# EAGLE design PANELMETRE_arduino_v4 (EAGLE 7.7.0)
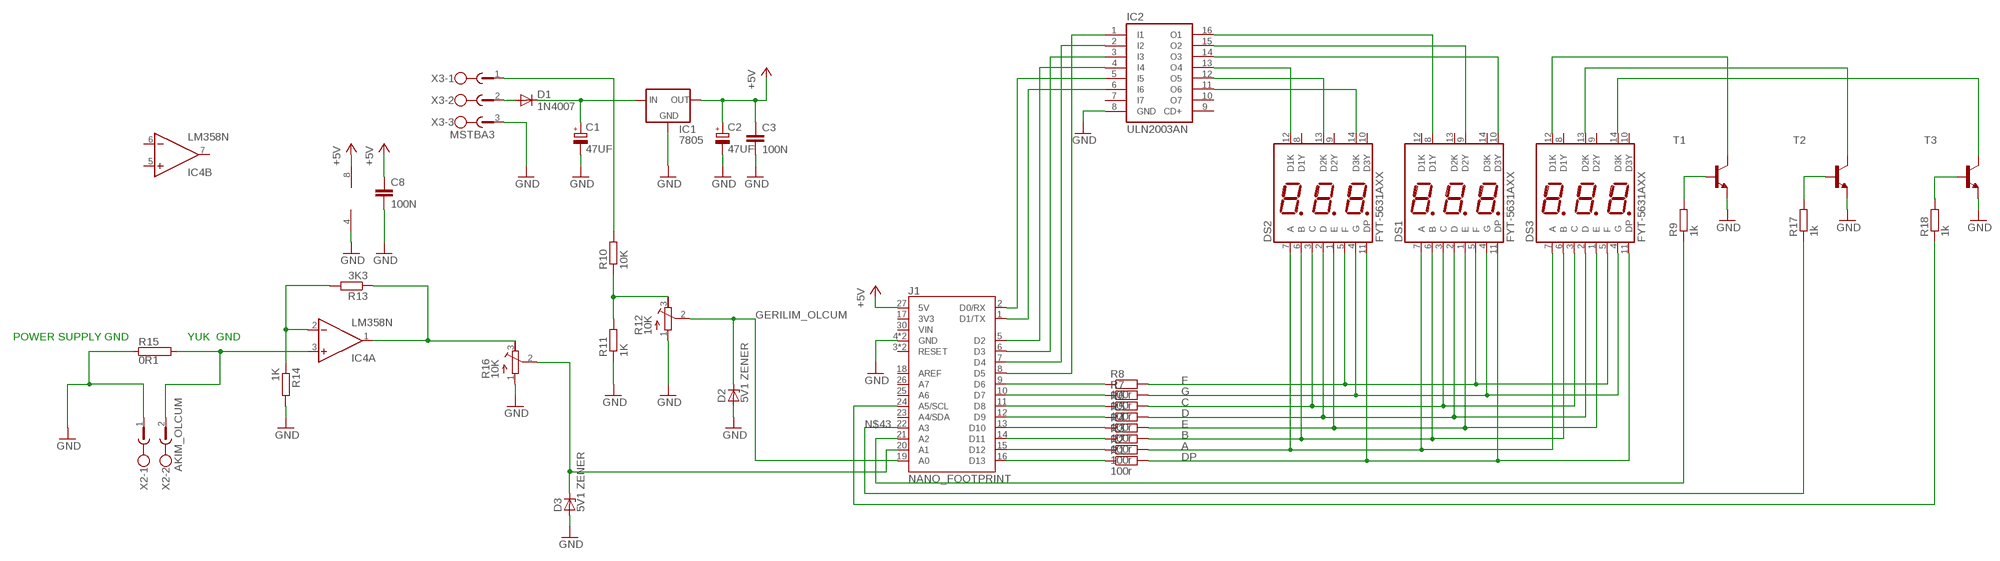
[diagram p0: schematic, sheet 1]

## Parts
C1  47UF  CPOL-EUE2-4  [E2-4]
C2  47UF  CPOL-EUE2-4  [E2-4]
C3  100N  C-EU050-024X044  [C050-024X044]
C8  100N  C-EU050-024X044  [C050-024X044]
D1  1N4007  1N4148DO35-10  [DO35-10]
D2  5V1 ZENER  ZENER-DIODEDO35Z10  [DO35Z10]
D3  5V1 ZENER  ZENER-DIODEDO35Z10  [DO35Z10]
DS1  FYT-5631AXX  DISPLAY  [DISPLAY]
DS2  FYT-5631AXX  DISPLAY  [DISPLAY]
DS3  FYT-5631AXX  DISPLAY  [DISPLAY]
IC1  7805  78MXXL  [78MXXL]
IC2  ULN2003AN  [DIL16]
IC4  LM358N  [DIL08]
J1  NANO_FOOTPRINT  [NANO]
R1  100r  R-EU_0207/10  [0207/10]
R2  100r  R-EU_0207/10  [0207/10]
R3  100r  R-EU_0207/10  [0207/10]
R4  100r  R-EU_0207/10  [0207/10]
R5  100r  R-EU_0207/10  [0207/10]
R6  100r  R-EU_0207/10  [0207/10]
R7  100r  R-EU_0207/10  [0207/10]
R8  100r  R-EU_0207/10  [0207/10]
R9  1k  R-EU_0207/10  [0207/10]
R10  10K  R-EU_0207/10  [0207/10]
R11  1K  R-EU_0207/10  [0207/10]
R12  10K  R-TRIMM64W  [RTRIM64W]
R13  3K3  R-EU_0207/10  [0207/10]
R14  1K  R-EU_0207/10  [0207/10]
R15  0R1  RRS10_38-39  [RS10_38-39]
R16  10K  R-TRIMM64W  [RTRIM64W]
R17  1k  R-EU_0207/10  [0207/10]
R18  1k  R-EU_0207/10  [0207/10]
T1  BC237-NPN-TO92-CBE  [TO92-CBE]
T2  BC237-NPN-TO92-CBE  [TO92-CBE]
T3  BC237-NPN-TO92-CBE  [TO92-CBE]
X2  AKIM_OLCUM  MSTBA2  [MSTBA2]
X3  MSTBA3  [MSTBA3]

## Nets
+5V: C2.+ C3.1 C8.1 IC1.OUT IC4.8(P:V+) J1.27(5V)
A: DS1.7(A) DS2.7(A) DS3.7(A) R2.2
AKIM_OLCUM: D3.C J1.20(A1) R16.2(S)
B: DS1.6(B) DS2.6(B) DS3.6(B) R3.2
C: DS1.3(C) DS2.3(C) DS3.3(C) R6.2
D: DS1.2(D) DS2.2(D) DS3.2(D) R5.2
DP: DS1.11(DP) DS2.11(DP) DS3.11(DP) R1.2
E: DS1.1(E) DS2.1(E) DS3.1(E) R4.2
F: DS1.5(F) DS2.5(F) DS3.5(F) R8.2
G: DS1.4(G) DS2.4(G) DS3.4(G) R7.2
GERILIM_OLCUM: D2.C J1.19(A0) R12.2(S)
GND: C1.- C2.- C3.2 C8.2 D2.A D3.A IC1.GND IC2.8(GND) IC4.4(P:V-) J1.4(GND) J1.29(GND) R11.1 R12.1(A) R14.2 R15.1 R16.1(A) T1.E T2.E T3.E X2.1 X3.3
N$1: J1.16(D13) R1.1
N$2: J1.15(D12) R2.1
N$3: J1.14(D11) R3.1
N$4: J1.13(D10) R4.1
N$5: J1.12(D9) R5.1
N$6: J1.11(D8) R6.1
N$7: J1.10(D7) R7.1
N$8: J1.9(D6) R8.1
N$17: DS1.8(D1Y) IC2.16(O1)
N$18: DS1.9(D2Y) IC2.15(O2)
N$19: DS1.10(D3Y) IC2.14(O3)
N$20: DS2.12(D1K) IC2.13(O4)
N$21: DS2.13(D2K) IC2.12(O5)
N$22: DS2.14(D3K) IC2.11(O6)
N$23: IC2.1(I1) J1.8(D5)
N$24: IC2.2(I2) J1.7(D4)
N$25: IC2.3(I3) J1.6(D3)
N$26: IC2.4(I4) J1.5(D2)
N$27: IC2.6(I6) J1.1(D1/TX)
N$28: IC2.5(I5) J1.2(D0/RX)
N$29: D1.A X3.2
N$30: C1.+ D1.C IC1.IN
N$31: R10.2 X3.1
N$32: IC4.2(A:-IN) R13.2 R14.1
N$33: R10.1 R11.2 R12.3(E)
N$34: DS3.12(D1K) T1.C
N$35: DS3.13(D2K) T2.C
N$36: IC4.3(A:+IN) R15.2 X2.2
N$37: IC4.1(A:OUT) R13.1 R16.3(E)
N$38: DS3.14(D3K) T3.C
N$39: R9.2 T1.B
N$40: R17.2 T2.B
N$41: R18.2 T3.B
N$42: J1.21(A2) R9.1
N$43: J1.22(A3) R17.1
N$44: J1.24(A5/SCL) R18.1
Unconnected: DS1.12(D1K) DS1.13(D2K) DS1.14(D3K) DS2.8(D1Y) DS2.9(D2Y) DS2.10(D3Y) DS3.8(D1Y) DS3.9(D2Y) DS3.10(D3Y) IC2.7(I7) IC2.9(CD+) IC2.10(O7) IC4.5(B:+IN) IC4.6(B:-IN) IC4.7(B:OUT) J1.3(RESET) J1.17(3V3) J1.18(AREF) J1.23(A4/SDA) J1.25(A6) J1.26(A7) J1.28(RESET) J1.30(VIN)

## Notes on the sheet
- POWER SUPPLY GND | YUK  GND

## Library data of the parts
C1 C2 = rcl:CPOL-EU: POLARIZED CAPACITOR, European symbol
C3 C8 = rcl:C-EU: CAPACITOR, European symbol
D1 = diode:1N4148: DIODE high speed (Philips)
D2 D3 = diode:ZENER-DIODE: Z-Diode
DS1-DS3 = KOPRUDIYOT:DISPLAY
IC1 = v-reg:78MXXL: VOLTAGE REGULATOR
IC2 = uln-udn:ULN2003A: DRIVER ARRAY
IC4 = linear:LM358: OP AMP also LM158; LM258; LM2904 Source: http://cache.national.com/ds/LM/LM158.pdf
J1 = SparkFun-Boards:NANO_FOOTPRINT: Generic Nano Footprint
R1-R11 R13 R14 R17 R18 = rcl:R-EU_: RESISTOR, European symbol
R12 R16 = rcl:R-TRIMM: Trimm resistor
R15 = resistor-power:R: Power Resitor; OC_FARNELL: unknown; OC_NEWARK: unknown
T1-T3 = transistor:*-NPN-: NPN Transistror BF959 corrected 2008.03.06
X2 = con-phoenix-508:MSTBA2: PHOENIX; MF: FARNELL; MPN: 1757242; OC_FARNELL: 3705171; OC_NEWARK: 71C4161
X3 = con-phoenix-508:MSTBA3: PHOENIX; MF: FARNELL; MPN: 1757255; OC_FARNELL: 3705183; OC_NEWARK: 71C4162

## Board
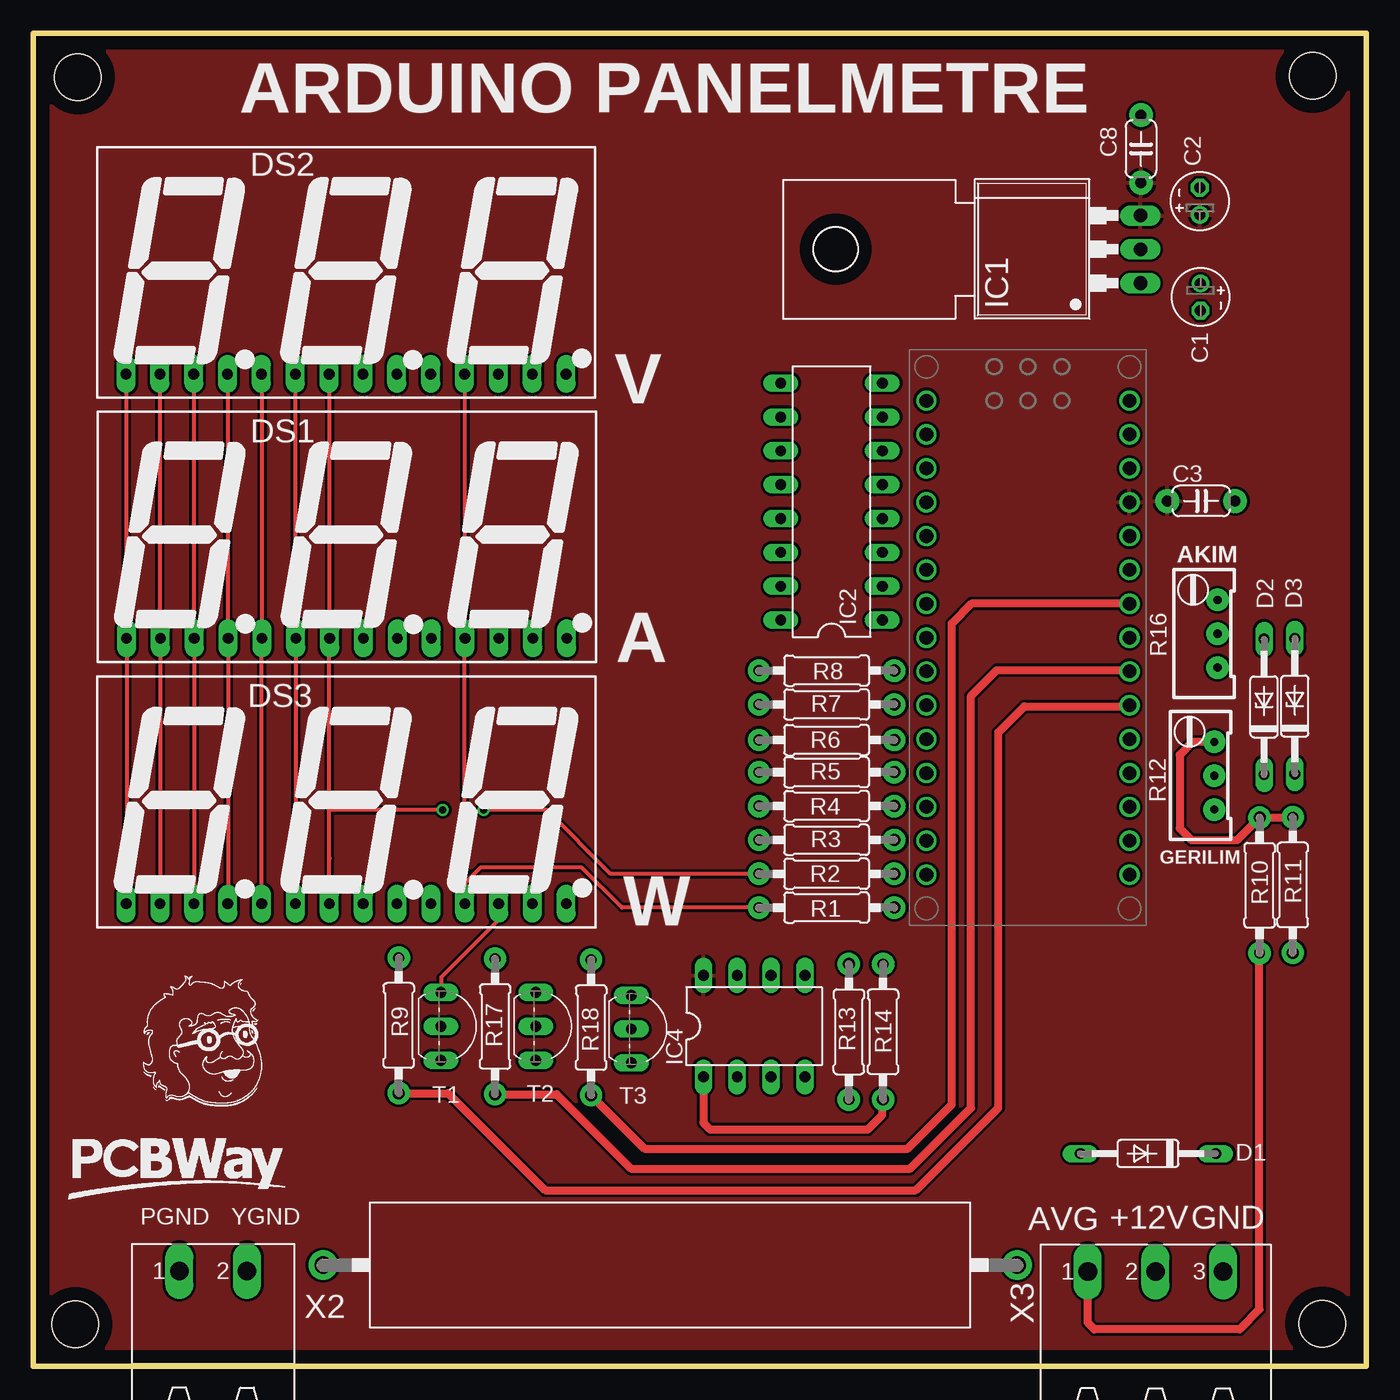
[diagram p1: board, top side]
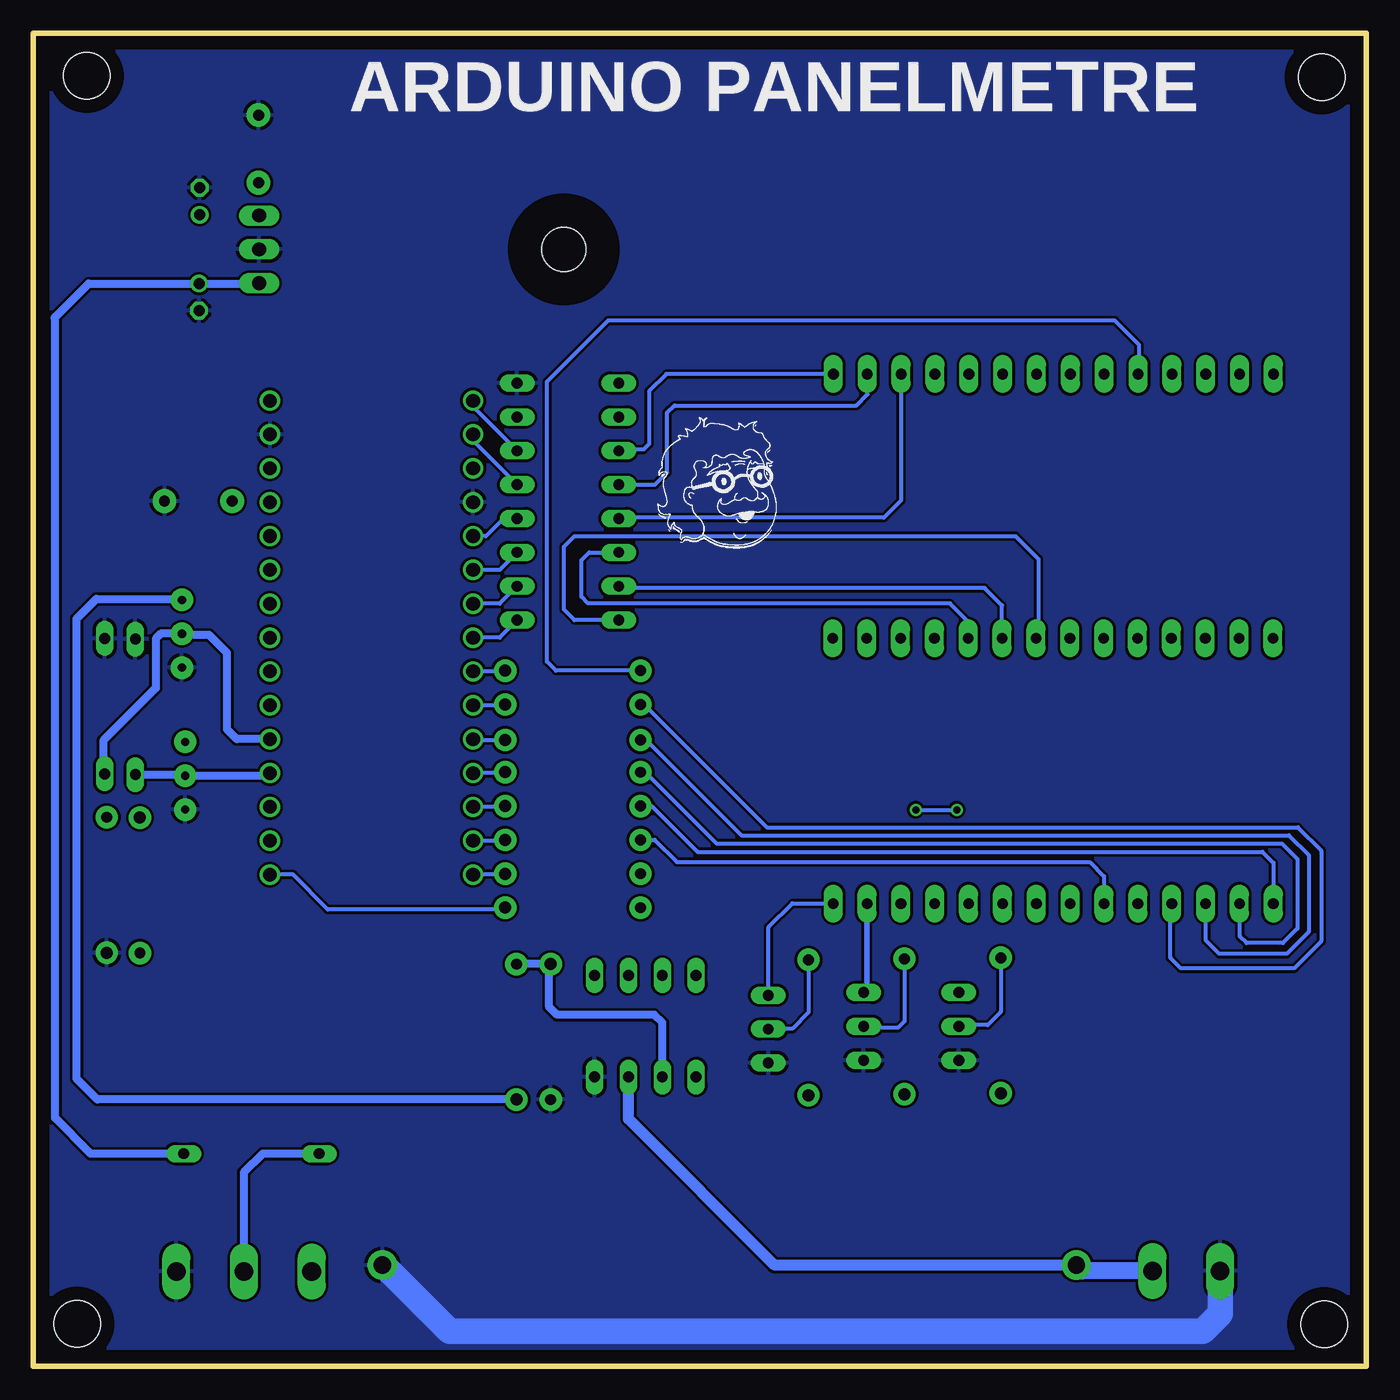
[diagram p2: board, bottom side, seen from below]

Size 100 x 100 mm. Coordinates in mm from the lower left corner, seen from the top.
Outline: 0,0 100,0 100,100 0,100 0,0
Copper layers (1*16): Top 0.035mm / dielectric 1.5mm / Bottom 0.035mm
Design rules "default": minimum track width 10mil, minimum drill 24mil, track to track 8mil, track to pad 8mil, pad to pad 8mil, via to via 8mil, smd to smd 8mil, copper to edge 40mil, drill to drill 8mil, minimum pad ring 10mil, minimum via ring 8mil, stop-mask expansion 4mil, vias tented up to drill 0mil, thermal gap 10mil
Holes 3.5 mm at 3.16,3.14 3.34,96.7 96,96.8 96.71,3.18

### Footprints (pad centres in the part's own frame; a part is rotated, then mirrored left to right if it is on the bottom)
E2-4 = drill 0.813 pad 1.27: + -1.016,0 | drill 0.813 pad 1.27 octagon: - 1.016,0
C050-024X044 = drill 0.813 pad 1.778: 1 -2.54,0; 2 2.54,0
DO35-10 = drill 0.813 long: A 5.08,0; C -5.08,0
DO35Z10 = drill 0.813 long: A 5.08,0; C -5.08,0
DISPLAY = drill 0.8 pad 1.422 long: 1 -16.51,-7.62; 2 -13.97,-7.62; 3 -11.43,-7.62; 4 -8.89,-7.62; 5 -6.35,-7.62; 6 -3.81,-7.62; 7 -1.27,-7.62; 8 1.27,-7.62; 9 3.81,-7.62; 10 6.35,-7.62; 11 8.89,-7.62; 12 11.43,-7.62; 13 13.97,-7.62; 14 16.51,-7.62
78MXXL = drill 1.016 long: GND 0,-5.08; IN -2.54,-5.08; OUT 2.54,-5.08 | hole 3.302: 0,17.78
DIL16 = drill 0.813 long: 1 -8.89,-3.81; 2 -6.35,-3.81; 3 -3.81,-3.81; 4 -1.27,-3.81; 5 1.27,-3.81; 6 3.81,-3.81; 7 6.35,-3.81; 8 8.89,-3.81; 9 8.89,3.81; 10 6.35,3.81; 11 3.81,3.81; 12 1.27,3.81; 13 -1.27,3.81; 14 -3.81,3.81; 15 -6.35,3.81; 16 -8.89,3.81
DIL08 = drill 0.813 pad 1.27 long: 1 -3.81,-3.81; 2 -1.27,-3.81; 3 1.27,-3.81; 4 3.81,-3.81; 5 3.81,3.81; 6 1.27,3.81; 7 -1.27,3.81; 8 -3.81,3.81
NANO = drill 1.016: 1 -7.62,17.78; 2 -7.62,15.24; 3 -7.62,12.7; 4 -7.62,10.16; 5 -7.62,7.62; 6 -7.62,5.08; 7 -7.62,2.54; 8 -7.62,0; 9 -7.62,-2.54; 10 -7.62,-5.08; 11 -7.62,-7.62; 12 -7.62,-10.16; 13 -7.62,-12.7; 14 -7.62,-15.24; 15 -7.62,-17.78; 16 7.62,-17.78; 17 7.62,-15.24; 18 7.62,-12.7; 19 7.62,-10.16; 20 7.62,-7.62; 21 7.62,-5.08; 22 7.62,-2.54; 23 7.62,0; 24 7.62,2.54; 25 7.62,5.08; 26 7.62,7.62; 27 7.62,10.16; 28 7.62,12.7; 29 7.62,15.24; 30 7.62,17.78
0207/10 = drill 0.9 pad 1.676: 1 -5.08,0 | drill 0.813 pad 1.676: 2 5.08,0
RTRIM64W = drill 0.61 pad 1.676: 1 1.27,-2.54; 2 1.27,0; 3 1.27,2.54
RS10_38-39 = drill 1.3 pad 2.2: 1 -26.035,0; 2 26.035,0
TO92-CBE = drill 0.813 long: B 0,0; C -2.54,0; E 2.54,0
MSTBA2 = drill 1.397 long: 1 -2.54,5.08; 2 2.54,5.08
MSTBA3 = drill 1.397 long: 1 -5.08,5.08; 2 0,5.08; 3 5.08,5.08

### Placement (x,y rotation side)
C1  87.56,80.21 270 top
C2  87.52,87.4 90 top
C3  87.62,64.91 0 top
C8  83.11,91.33 90 top
D1  83.63,15.95 180 top
D2  92.34,49.47 90 top
D3  94.65,49.52 90 top
DS1  23.5,62.23 0 top
DS2  23.46,82.06 0 top
DS3  23.48,42.33 0 top
IC1  77.98,83.79 90 top
IC2  59.89,64.87 90 top
IC4  54.08,25.51 0 top
J1  74.63,54.66 0 top
R1  59.52,34.4 180 top
R2  59.52,36.94 180 top
R3  59.52,39.48 180 top
R4  59.52,42.02 180 top
R5  59.52,44.56 180 top
R6  59.52,46.98 180 top
R7  59.52,49.64 180 top
R8  59.52,52.18 180 top
R9  27.41,25.56 90 top
R10  92,36.08 270 top
R11  94.49,36.1 90 top
R12  87.34,44.3 0 top
R13  63.75,25.09 90 top
R14  61.19,25.09 270 top
R15  47.77,7.58 180 top
R16  87.58,54.95 0 top
R17  34.64,25.49 90 top
R18  41.85,25.41 90 top
T1  30.57,25.49 270 top
T2  37.7,25.49 270 top
T3  44.86,25.29 270 top
X2  13.49,2.07 0 top
X3  84.2,2.02 0 top

### Tracks (layer width: path | path; a pad name or v marks a point on that pad's centre or on a via)
+5V
  pour Top: -12.6,106.25 103.1,106.25 103.1,-3.45 -12.6,-3.45
A  (via drill 0.5)
  Top 0.305: DS3.7 22.21,38.15 | 22.21,38.15 22.21,41.73 | R2.2 43.32,36.94 38.53,41.73 v33.78,41.73 | 22.23,38.12 22.21,38.15 | v30.71,41.73 22.21,41.73 | 22.21,41.73 22.21,54.59 DS1.7 22.23,74.4 DS2.7
  Bottom 0.305: v33.78,41.73 v30.71,41.73
AKIM_OLCUM
  Bottom 0.61: D3.C 94.74,44.54 94.74,46.94 90.81,50.88 90.81,54.59 90.44,54.95 R16.2 88.76,54.86 86.82,54.86 85.47,53.52 85.47,47.78 84.73,47.04 J1.20
B
  Top 0.305: DS2.6 19.65,54.65 DS1.6 19.69,35.28 19.67,35.26 DS3.6
  Bottom 0.305: R3.2 53.38,39.48 51.71,37.82 20.73,37.82 19.67,36.75 DS3.6
C
  Top 0.305: DS2.3 12.03,54.65 DS1.3 12.07,34.73 DS3.3
  Bottom 0.305: R6.2 54.01,46.98 46.86,39.83 5.79,39.83 4.32,38.35 4.32,32.59 5.97,30.94 11.02,30.94 12.01,31.93 12.01,34.68 DS3.3
D
  Top 0.305: DS2.2 9.49,54.65 DS1.2 9.53,34.73 DS3.2
  Bottom 0.305: R5.2 54.09,44.56 48.74,39.22 6.32,39.22 5.16,38.05 5.16,32.84 6.25,31.75 8.97,31.75 9.47,32.26 9.47,34.68 DS3.2
DP
  Top 0.305: R1.2 44.16,34.4 41.15,37.41 33.55,37.41 32.39,36.25 32.39,34.73 DS3.11 32.37,54.59 DS1.11 32.39,74.4 DS2.11
E
  Top 0.305: DS2.1 6.95,54.65 DS1.1 6.99,34.73 DS3.1
  Bottom 0.305: R4.2 53.61,42.02 50.17,38.58 7.78,38.58 6.97,37.77 DS3.1
F
  Top 0.305: DS3.5 17.13,54.59 DS1.5 17.15,74.4 DS2.5
  Bottom 0.305: DS2.5 17.04,74.51 17.04,76.63 18.87,78.46 56.87,78.46 61.47,73.86 61.47,52.86 60.79,52.18 R8.2
G
  Top 0.305: DS2.4 14.57,54.65 DS1.4 14.61,34.73 DS3.4
  Bottom 0.305: R7.2 54.17,49.64 44.96,40.44 5.13,40.44 3.38,38.68 3.38,31.88 5.41,29.84 13.89,29.84 14.68,30.63 14.68,34.62 DS3.4
GERILIM_OLCUM
  Bottom 0.61: D2.C 88.7,44.39 R12.2 82.45,44.3 J1.19
GND
  Bottom 1.93: 10.95,7.19 10.95,3.94 12.27,2.62 68.76,2.62 73.84,7.7
  pour Bottom: -13.44,106.96 107.44,106.96 107.44,-5.23 -13.44,-5.23
N$1
  Bottom 0.305: R1.1 64.74,34.27 77.9,34.27 80.52,36.88 J1.16
N$2
  Bottom 0.305: J1.15 66.94,36.94 R2.1
  Bottom 0.406: 64.66,36.88 R2.1
N$3
  Bottom 0.305: R3.1 64.66,39.42 J1.14
N$4
  Bottom 0.305: R4.1 64.66,41.96 J1.13
N$5
  Bottom 0.305: R5.1 64.66,44.5 J1.12
  Bottom 0.406: 66.94,44.56 J1.12
N$6
  Bottom 0.305: J1.11 66.94,46.98 R6.1
N$7
  Bottom 0.305: R7.1 64.66,49.58 J1.10
N$8
  Bottom 0.305: R8.1 64.66,52.12 J1.9
N$17
  Bottom 0.305: DS1.8 24.59,54.8 24.59,60.55 26.31,62.28 59.41,62.28 60.2,61.49 60.2,56.77 59.41,55.98 IC2.16
N$18
  Bottom 0.305: DS1.9 27.31,57.08 28.63,58.4 55.96,58.4 IC2.15
N$19
  Bottom 0.305: DS1.10 29.79,54.67 29.79,55.8 31.22,57.23 58.37,57.23 58.88,57.73 58.88,60.48 58.29,61.06 IC2.14
N$20
  Bottom 0.305: DS2.12 34.89,64.95 36.2,63.65 56.02,63.65 IC2.13
N$21
  Bottom 0.305: IC2.12 53.37,66.14 52.45,67.06 52.45,71.53 51.89,72.08 38.25,72.08 37.41,72.92 37.41,74.42 DS2.13
N$22
  Bottom 0.305: IC2.11 55.97,68.78 54.2,68.78 53.8,69.19 53.8,73.15 52.51,74.44 DS2.14
N$23
  Bottom 0.305: IC2.1 65.02,54.66 J1.8
N$24
  Bottom 0.305: IC2.2 65.02,57.2 J1.7
N$25
  Bottom 0.305: IC2.3 65.02,59.74 J1.6
N$26
  Bottom 0.305: IC2.4 63.86,63.75 64.57,63.75 66.04,62.28 J1.5
N$27
  Bottom 0.305: IC2.6 67.01,71.98 J1.1
N$28
  Bottom 0.305: IC2.5 67.01,69.44 J1.2
N$29
  Bottom 0.61: D1.A 82.78,15.95 84.2,14.53 X3.2
N$30
  Bottom 0.61: 98.43,78.66 98.37,78.72 | IC1.IN 83.09,81.23 C1.+ 95.86,81.23 98.3,78.79 98.37,78.72 | D1.C 95.7,15.95 98.37,18.62 98.37,78.72
N$31
  Top 0.61: R10.2 92,4.27 90.5,2.77 79.6,2.77 79.12,3.26 X3.1
N$32
  Bottom 0.61: IC4.2 52.81,25.76 53.42,26.36 60.71,26.36 61.29,26.95 61.29,30.06 R14.1 R13.2
N$33
  Top 0.61: R12.3 86.97,46.84 86,45.87 86,40.36 86.89,39.47 90.31,39.47 R10.1 94.47,41.16 R11.2
N$34
  Top 0.305: 30.5,27.96 T1.C 30.61,28.07 30.61,29.18 34.91,33.48 DS3.12
N$35
  Bottom 0.406: T2.C 37.45,28.03 DS3.13
N$36
  Bottom 0.813: R15.2 44.39,7.58 55.35,18.54 IC4.3
  Bottom 1.27: X2.2 21.3,7.15 R15.2
N$37
  Top 0.61: IC4.1 50.27,18.26 50.77,17.75 62.61,17.75 63.7,18.85 63.7,19.96 R13.1
  Bottom 0.61: R13.1 95.19,20 96.75,21.57 96.75,56.08 95.28,57.56 88.92,57.56 R16.3
N$38
  Bottom 0.305: T3.C 44.83,32.94 43.05,34.72 40,34.72 DS3.14
N$39
  Bottom 0.305: R9.2 27.41,26.59 28.4,25.6 30.46,25.6 T1.B
N$40
  Bottom 0.305: T2.B 37.61,25.4 35.13,25.4 34.64,25.89 R17.2
N$41
  Bottom 0.305: R18.2 41.85,26.53 43.05,25.32 44.83,25.32 T3.B
N$42
  Top 0.61: R9.1 31.13,20.48 38.4,13.21 66.22,13.21 72.39,19.38 72.39,47.55 74.35,49.51 82.17,49.51 J1.21
N$43
  Top 0.61: R17.1 39.26,20.41 44.86,14.81 65.79,14.81 70.36,19.38 70.36,50.29 72.29,52.22 82.14,52.22 J1.22
N$44
  Top 0.61: R18.1 45.87,16.31 65.58,16.31 68.91,19.63 68.91,55.73 70.38,57.2 J1.24

### Text on the board
tNames: ARDUINO PANELMETRE | V | AKIM | A | GERILIM | W | D:/YOUTUBE/PCBWAY_2.bmp | PGND | AVG | +12V | GND | YGND
bNames: ARDUINO PANELMETRE